# EasyEDA schematic SCH_create_2023-03-12.json
TITLE: 摔跤检测计; REV: 1.0; Date: 2023-02-18; Sheet: 1/1; Drawn By: luoya; Company: 自动化202 梁瀚严 罗望龙 谢鸿健
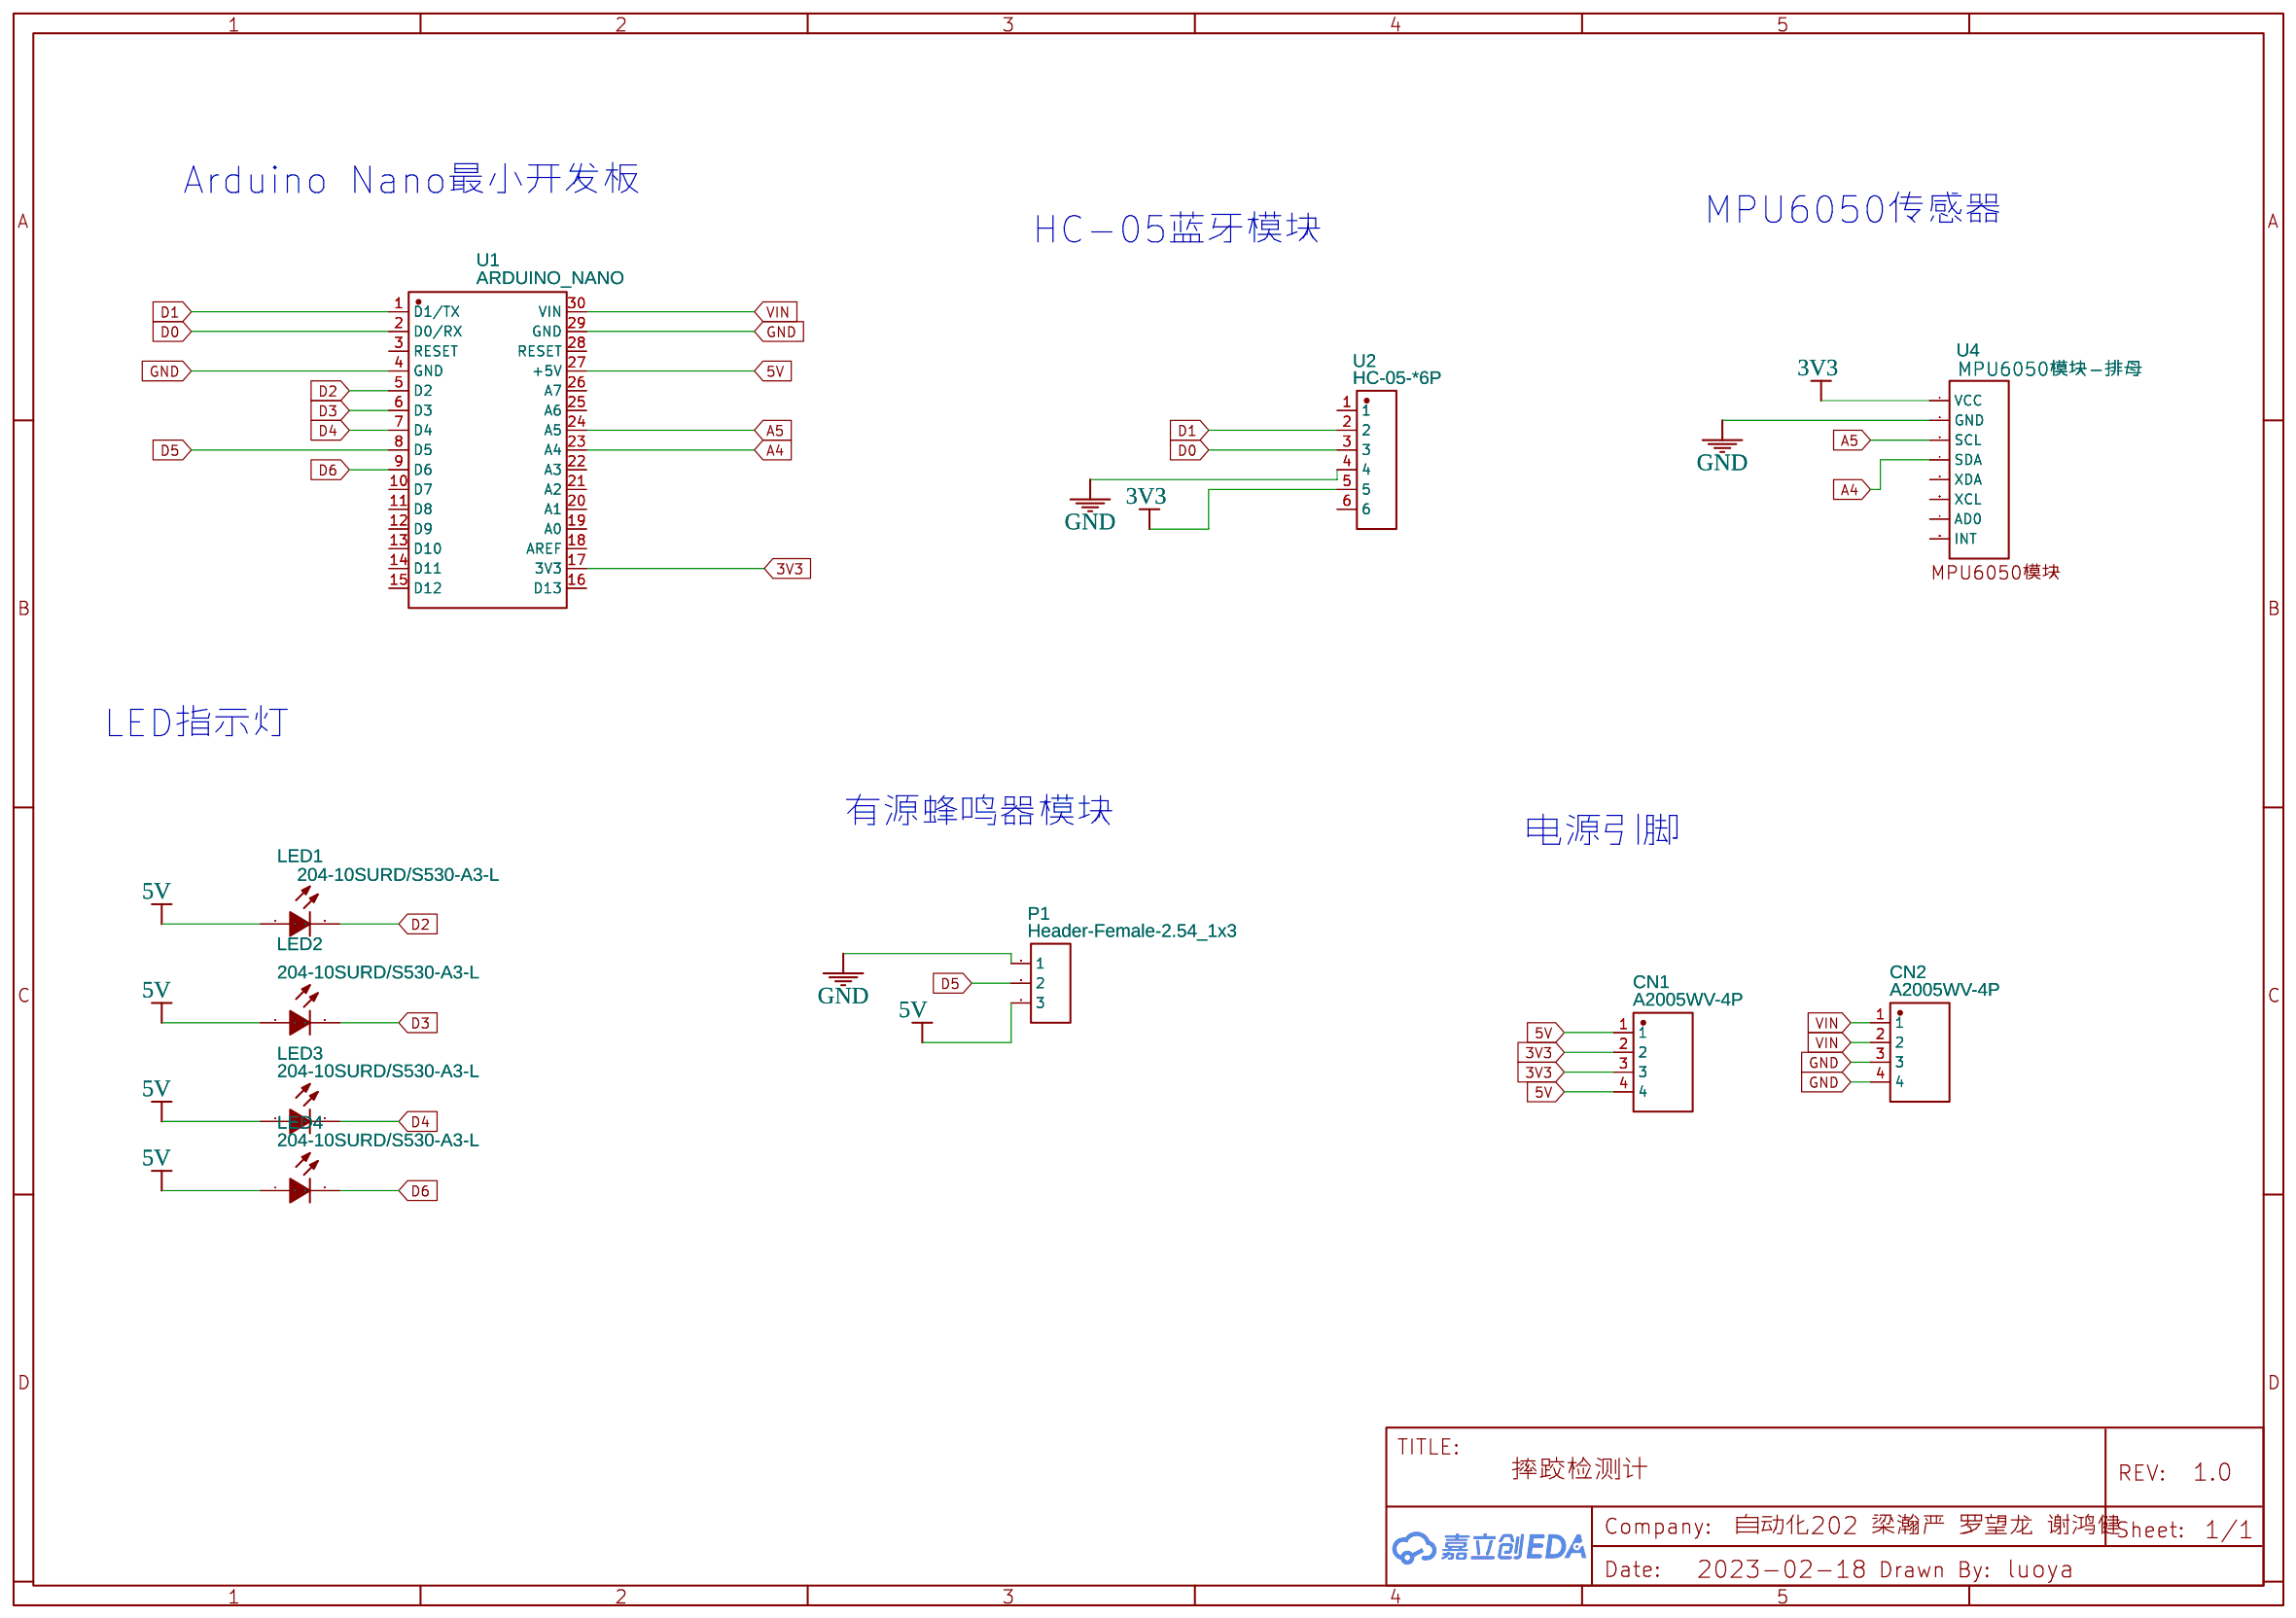
[diagram p0: schematic sheet]

## Parts
CN1  A2005WV-4P  [HDR-TH_4P-P2.00-V-M]
CN2  A2005WV-4P  [HDR-TH_4P-P2.00-V-M]
LED1  204-10SURD/S530-A3-L  [LED-TH_BD3.0-P2.54-FD]
LED2  204-10SURD/S530-A3-L  [LED-TH_BD3.0-P2.54-FD]
LED3  204-10SURD/S530-A3-L  [LED-TH_BD3.0-P2.54-FD]
LED4  204-10SURD/S530-A3-L  [LED-TH_BD3.0-P2.54-FD]
P1  Header-Female-2.54_1x3  [HDR-TH_3P-P2.54-V-F]
U1  ARDUINO_NANO  [COMM-TH_ARDUINO_NANO]
U2  HC-05-*6P  [HDR-TH_6P-P2.50-V-F-R1-C6]
U4  MPU6050模块-排母  [MPU6050模块-排母-PCB]

## Library data of the parts
CN1 CN2 = A2005WV-4P: Supplier: LCSC; Supplier Part: C225256; Manufacturer: CJT(长江连接器); Contributor: LCSC; JLCPCB Part Class: Extended Part
LED1-LED4 = 204-10SURD/S530-A3-L: Supplier: LCSC; Manufacturer: EVERLIGHT(亿光); Supplier Part: C99771; JLCPCB Part Class: Extended Part
P1 = Header-Female-2.54_1x3: Supplier Part: C146243; Supplier: LCSC; Manufacturer: BOOMELE(博穆精密); Manufacturer Part: 2.54-1*3P母; link: https://datasheet.lcsc.com/szlcsc/Boom-Precision-Elec-2-54mm-1-8P-Straight-Female-header_C27438.pdf; JLCPCB Part Class: Extended Part
U1 = ARDUINO_NANO: Supplier: LCSC; Supplier Part: C9900017879; Manufacturer: null; JLCPCB Part Class: Extended Part; Contributor: lcsc
U2 = HC-05-*6P: Supplier: LCSC; Supplier Part: C9900003093; Manufacturer: null; Manufacturer Part: HC-05_排母*6P; Contributor: LCSC; JLCPCB Part Class: Extended Part
U4 = MPU6050模块-排母: Contributor: W429367425

## Nets
3V3: CN1.2 CN1.3 U1.17(3V3) U2.5 U4.1(VCC)
5V: CN1.1 CN1.4 LED1.1(A) LED2.1(A) LED3.1(A) LED4.1(A) P1.3 U1.27(+5V)
GND: CN2.3 CN2.4 P1.1 U1.4(GND) U1.29(GND) U2.4 U4.2(GND)
VIN: CN2.1 CN2.2 U1.30(VIN)
A4: U1.23(A4) U4.4(SDA)
A5: U1.24(A5) U4.3(SCL)
D0: U1.2(D0/RX) U2.3
D1: U1.1(D1/TX) U2.2
D2: LED1.2(K) U1.5(D2)
D3: LED2.2(K) U1.6(D3)
D4: LED3.2(K) U1.7(D4)
D5: P1.2 U1.8(D5)
D6: LED4.2(K) U1.9(D6)

Not connected (* = marked no-connect by the designer): U1 3(RESET) 10(D7) 11(D8) 12(D9) 13(D10) 14(D11) 15(D12) 16(D13) 18(AREF) 19(A0) 20(A1) 21(A2) 22(A3) 25(A6) 26(A7) 28(RESET); U2 1 6; U4 5(XDA) 6(XCL) 7(AD0) 8(INT)

## Notes on the sheet
- Arduino Nano最小开发板
- MPU6050传感器
- HC-05蓝牙模块
- LED指示灯
- 有源蜂鸣器模块
- 电源引脚
